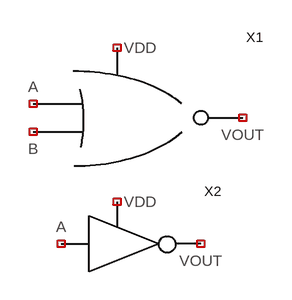
[diagram p0: schematic demux2.asc]
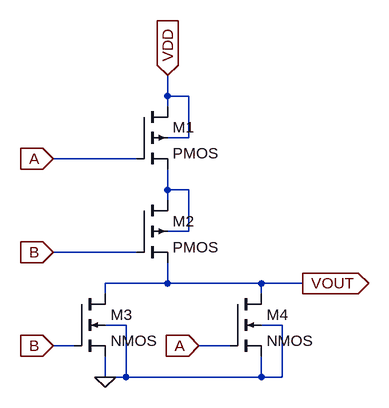
[diagram p1: sub-circuit nor.asc]
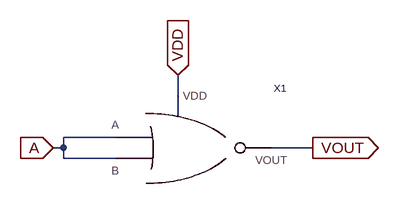
[diagram p2: sub-circuit not.asc]
demux2.asc, the LTspice schematic file:
Version 4.1
SHEET 1 880 680
SYMBOL nor 160 144 R0
SYMATTR InstName X1
SYMBOL not 144 288 R0
SYMATTR InstName X2

nor.asc, the sub-circuit schematic file:
Version 4.1
SHEET 1 1028 680
WIRE 272 80 272 48
WIRE 304 80 272 80
WIRE 272 96 272 80
WIRE 304 144 304 80
WIRE 304 144 272 144
WIRE 224 176 96 176
WIRE 272 224 272 192
WIRE 304 224 272 224
WIRE 272 240 272 224
WIRE 304 288 304 224
WIRE 304 288 272 288
WIRE 224 320 96 320
WIRE 272 368 272 336
WIRE 272 368 176 368
WIRE 416 368 272 368
WIRE 480 368 416 368
WIRE 176 384 176 368
WIRE 416 384 416 368
WIRE 208 432 176 432
WIRE 448 432 416 432
WIRE 128 464 96 464
WIRE 368 464 320 464
WIRE 176 512 176 480
WIRE 208 512 208 432
WIRE 208 512 176 512
WIRE 416 512 416 480
WIRE 416 512 208 512
WIRE 448 512 448 432
WIRE 448 512 416 512
FLAG 96 176 A
IOPIN 96 176 In
FLAG 272 48 VDD
IOPIN 272 48 In
FLAG 96 320 B
IOPIN 96 320 In
FLAG 480 368 VOUT
IOPIN 480 368 Out
FLAG 176 512 0
FLAG 320 464 A
IOPIN 320 464 In
FLAG 96 464 B
IOPIN 96 464 In
SYMBOL pmos4 224 96 R0
SYMATTR InstName M1
SYMATTR Value2 l=90n w=400n
SYMBOL pmos4 224 240 R0
SYMATTR InstName M2
SYMATTR Value2 l=90n w=400n
SYMBOL nmos4 368 384 R0
SYMATTR InstName M4
SYMATTR Value2 l=90n w=200n
SYMBOL nmos4 128 384 R0
SYMATTR InstName M3
SYMATTR Value2 l=90n w=200n

not.asc, the sub-circuit schematic file:
Version 4.1
SHEET 1 880 680
WIRE 224 96 224 64
WIRE 128 160 48 160
WIRE 48 176 48 160
WIRE 48 176 32 176
WIRE 432 176 368 176
WIRE 48 192 48 176
WIRE 128 192 48 192
FLAG 224 64 VDD
IOPIN 224 64 In
FLAG 32 176 A
IOPIN 32 176 In
FLAG 432 176 VOUT
IOPIN 432 176 Out
SYMBOL nor 240 176 R0
SYMATTR InstName X1

The netlist it stands for:
* demux2.asc
X§X1 NC_01 NC_02 NC_03 NC_04 nor
X§X2 NC_05 NC_06 NC_07 not

* block symbol definitions
.subckt nor A B VDD VOUT
M1 VDD A N001 VDD PMOS l=90n w=400n
M2 N001 B VOUT N001 PMOS l=90n w=400n
M4 VOUT A 0 0 NMOS l=90n w=200n
M3 VOUT B 0 0 NMOS l=90n w=200n
.ends nor

.subckt not VDD A VOUT
X§X1 A A VDD VOUT nor
.ends not

.model NMOS NMOS
.model PMOS PMOS
.lib standard.mos
.backanno
.end